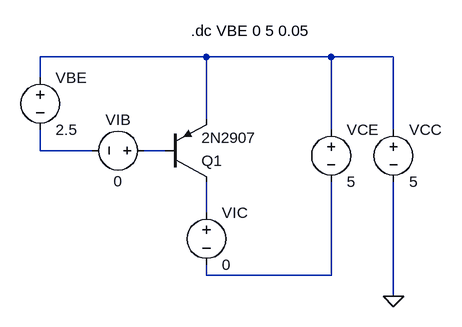
[diagram p0: schematic pnp_Ib_2.asc]
pnp_Ib_2.asc, the LTspice schematic file:
Version 4
SHEET 1 880 680
WIRE 256 -656 0 -656
WIRE 448 -656 256 -656
WIRE 544 -656 448 -656
WIRE 0 -624 0 -656
WIRE 256 -560 256 -656
WIRE 448 -544 448 -656
WIRE 544 -544 544 -656
WIRE 0 -512 0 -544
WIRE 80 -512 0 -512
WIRE 192 -512 160 -512
WIRE 256 -416 256 -464
WIRE 256 -320 256 -336
WIRE 448 -320 448 -464
WIRE 448 -320 256 -320
WIRE 544 -288 544 -464
FLAG 544 -288 0
SYMBOL pnp 192 -464 M180
SYMATTR InstName Q1
SYMATTR Value 2N2907
SYMBOL voltage 544 -560 R0
WINDOW 123 0 0 Left 0
WINDOW 39 0 0 Left 0
SYMATTR InstName VCC
SYMATTR Value 5
SYMBOL voltage 448 -560 R0
WINDOW 123 0 0 Left 0
WINDOW 39 0 0 Left 0
SYMATTR InstName VCE
SYMATTR Value 5
SYMBOL voltage 0 -640 R0
WINDOW 123 0 0 Left 0
WINDOW 39 0 0 Left 0
SYMATTR InstName VBE
SYMATTR Value 2.5
SYMBOL voltage 176 -512 R90
WINDOW 0 -32 56 VBottom 2
WINDOW 3 32 56 VTop 2
WINDOW 123 0 0 Left 0
WINDOW 39 0 0 Left 0
SYMATTR InstName VIB
SYMATTR Value 0
SYMBOL voltage 256 -432 R0
WINDOW 123 0 0 Left 0
WINDOW 39 0 0 Left 0
SYMATTR InstName VIC
SYMATTR Value 0
TEXT 232 -696 Left 2 !.dc VBE 0 5 0.05

The netlist it stands for:
* pnp_Ib_2.asc
Q1 N004 N003 N001 0 2N2907
VCC N001 0 5
VCE N001 N005 5
VBE N001 N002 2.5
VIB N003 N002 0
VIC N004 N005 0
.model NPN NPN
.model PNP PNP
.lib standard.bjt
.dc VBE 0 5 0.05
.backanno
.end